# EAGLE design switch-smd-20mm-mk-2.0 (EAGLE 7.5.0)
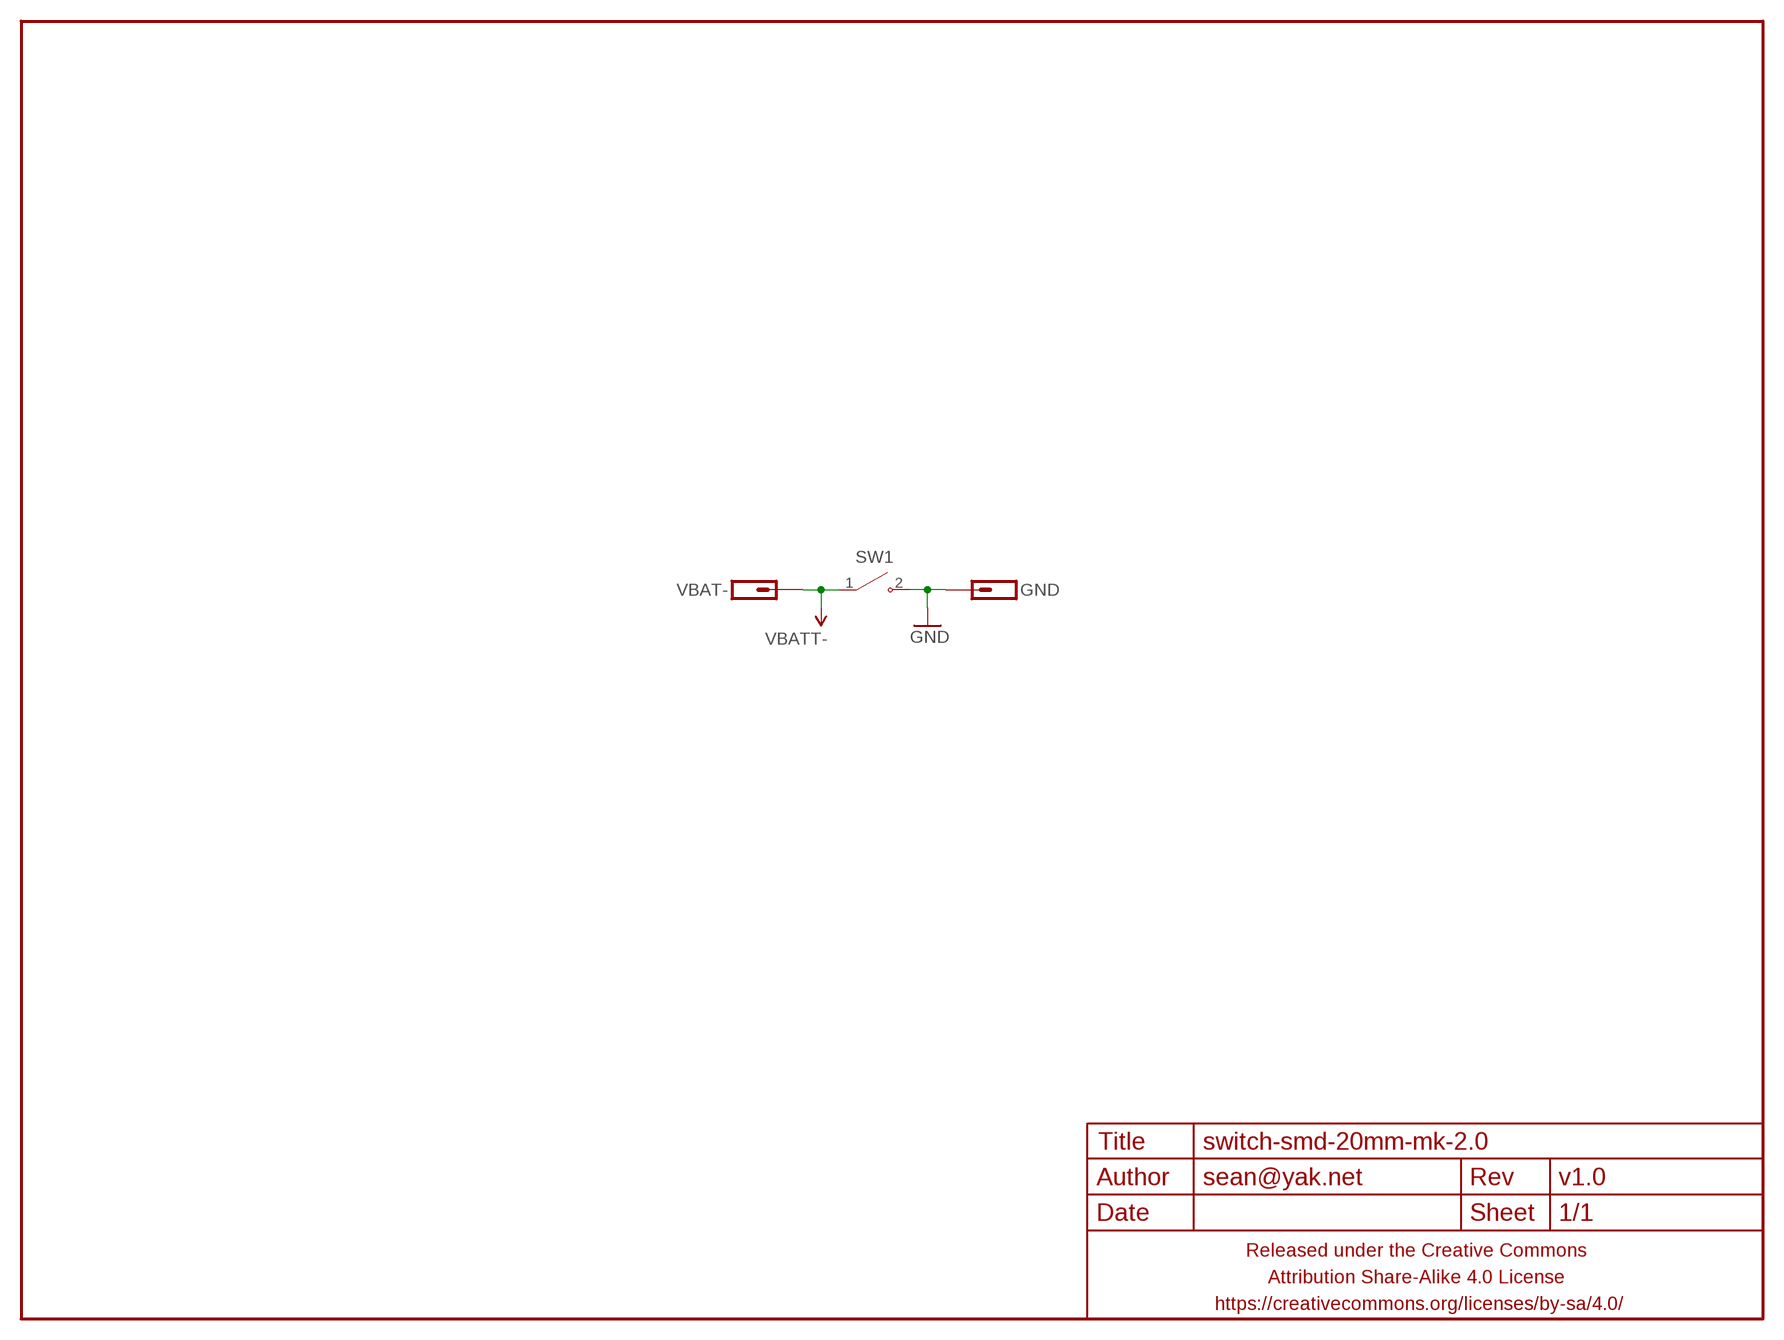
[diagram p0: schematic, sheet 1]

## Parts
FRAME1  FRAME-LETTERNO_PACKAGE  [DUMMY]
GND  M01NOT-A-VIA-NOPE  [1X01_NOSILK_NOSTOP]
SW1  SWITCH-SPSTKAN-9-SMD-SMOL-TWO-SIDES  [KAN-9-SMD-SMOL-TWO-SIDES]
VBAT-  M01PTH-1MM-CIR-NS  [1X01-1MM-CIR-NS]

## Nets
GND: GND.P$1 SW1.2(NO)
VBAT: SW1.1(COM) VBAT-.1 ; supply symbol labelled VBATT-

## Library data of the parts
FRAME1 = a_parts:FRAME-LETTER: Schematic Frame Standard 8.5x11 US Letter frame; DESIGNER: sean@yak.net; VERSION: v1.0
GND VBAT- = a_parts:M01: Header 1 Standard 1-pin 0.1" header. Use with straight break away headers (SKU : PRT-00116), right angle break away headers (PRT-00553), swiss pins (PRT-00743), machine pins (PRT-00117), and female headers (PRT-00115).
SW1 = a_parts:SWITCH-SPST

## Board
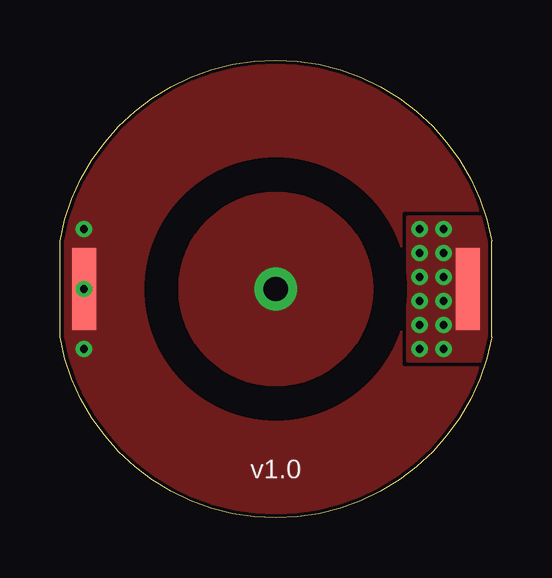
[diagram p1: board, top side]
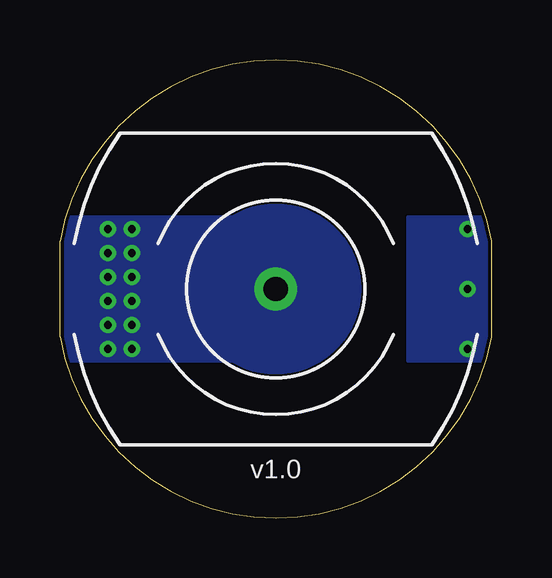
[diagram p2: board, bottom side, seen from below]

Size 18 x 19.1 mm. Coordinates in mm from the lower left corner, seen from the top.
Outline: 18,7.55 arc-160 0,7.55 0,11.55 arc-160 18,11.55 18,7.55
Copper layers (1*16): Top 0.0356mm / dielectric 1.5011mm / Bottom 0.0356mm
Design rules "LaenPCBOrder2 *": minimum track width 6mil, minimum drill 13mil, track to track 6mil, track to pad 6mil, pad to pad 6mil, via to via 6mil, smd to smd 6mil, copper to edge 3mil, drill to drill 6mil, minimum pad ring 7mil, minimum via ring 7mil, stop-mask expansion 3mil, vias tented up to drill 20mil, thermal gap 10mil
tRestrict: area 3.8,4.3 to 14.2,14.8

### Footprints (pad centres in the part's own frame; a part is rotated, then mirrored left to right if it is on the bottom)
1X01_NOSILK_NOSTOP = drill 0.33: P$1 0,0
KAN-9-SMD-SMOL-TWO-SIDES = smd 1 x 3.4 bottom: 1 -8,0; 2 8,0
1X01-1MM-CIR-NS = drill 1.016 pad 1.778: 1 0,0

### Placement (x,y rotation side)
FRAME1  -1,-0.45 0 top
GND  1,9.55 90 bottom
SW1  9,9.55 0 bottom
VBAT-  9,9.55 0 top

### Tracks (layer width: path | path; a pad name or v marks a point on that pad's centre or on a via)
GND  (via drill 0.33)
  other vias: 1,12.05 1,7.05
  pour Bottom (isolate 0.152, rank 3, no thermals): 3.5,12.55 3.5,6.55 -1,6.55 -1,12.55
  pour Top (isolate 0.152, rank 6, no thermals): -1,-0.45 -1,19.55 19,19.55 19,-0.45
VBAT  (via drill 0.33)
  other vias: 16,12.05 16,7.05 16,10.05 16,11.05 16,8.05 15,7.05 15,8.05 15,10.05 15,11.05 15,12.05 15,9.05 16,9.05
  pour Top (isolate 0.152, no thermals): 5,9.55 arc-180 13,9.55 arc-180
  pour Bottom (isolate 0.152, rank 3, no thermals): 9,13.05 arc90 5.5,9.55 arc90 9,6.05 arc90 12.5,9.55 arc90
  pour Bottom (isolate 0.152, rank 3, no thermals): 7.5,12.55 19,12.55 19,6.55 7.5,6.55
  pour Bottom (isolate 0.152, rank 3, no thermals): 7.5,12.55 19,12.55 19,6.55 7.5,6.55
  pour Top (isolate 0.152, no thermals): 18,12.55 14.5,12.55 14.5,6.55 18,6.55